# Altium project main.PrjPCB
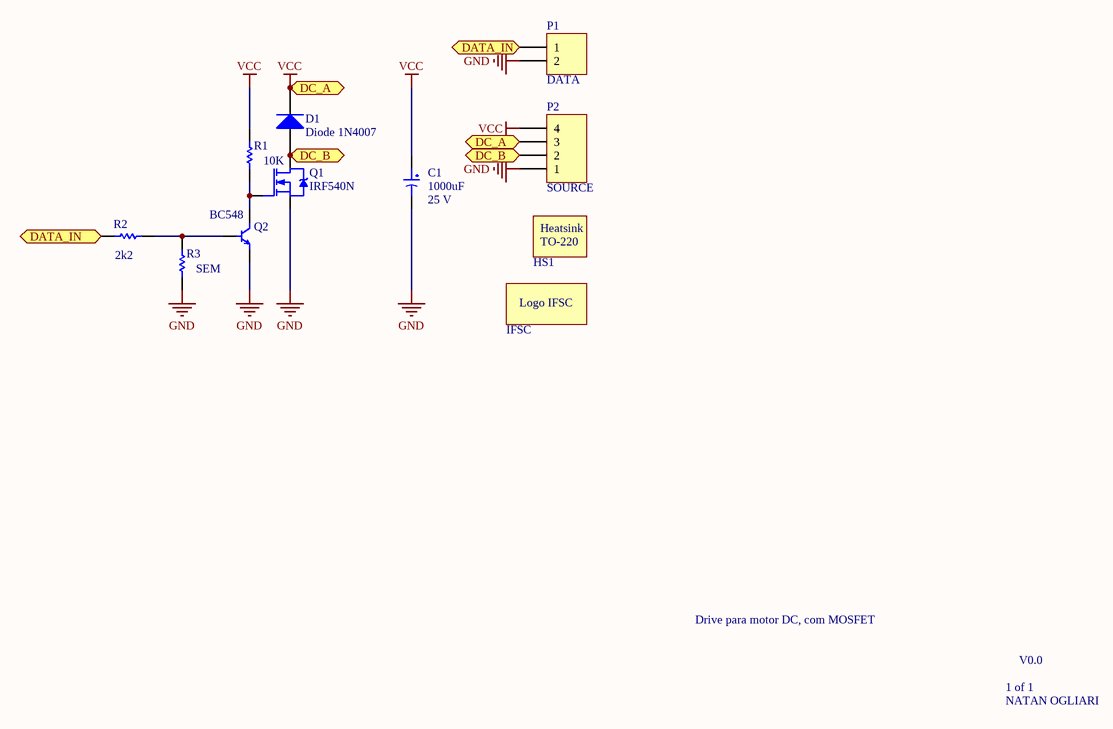
[diagram p0: Sheet1.SchDoc]
1 sheet, 11 parts. Net scope: flat (ports and power ports of the same name join across sheets).
Board file: PCB1.PcbDoc

## Sheet Sheet1.SchDoc
size A4; PageSetup: Record=PageOptions|CenterHorizontal=True|CenterVertical=True|PrintScale=1.00|XCorrection=1.00|YCorrection=1.00|PrintKind=0|BorderSize=5000000|LeftOffset=0|BottomOffset=0|Orientation=2|PaperLength=1000|PaperWidth=1000|Scale=100|PaperSource=7|PrintQuality=-4|MediaType=1|DitherType=10|PaperKind=A4|PrintScaleMode=0

### Parts
C1  1000uF  Voltage: 25 V  [CP-RAD-8.0mm-20.0mm-3.5mm]
D1  Diode 1N4007  [DO-41]
HS1  HS-TO-220  [HS-TO-220-180847]  (value not drawn)
P1  DATA  [HDR1X2]
P2  SOURCE  [KRE_4]
Q1  IRF540N  [TO-220/123]
Q2  BC548  [TO-92/CBE]
R1  value 10K  [AXIAL-0.5]  (hidden comment: Res Semi)
R2  value 2k2  [AXIAL-0.5]  (hidden comment: Res Semi)
R3  value SEM  [AXIAL-0.5]  (hidden comment: Res Semi)
X1  IFSC  [IFSC_SILK]

### Ports
DATA_IN (in), DATA_IN (out), DC_A (bidir), DC_B (bidir)

### Nets
GND: C1.2 P1.2 P2.1 Q1.S Q2.E R3.1
VCC: C1.1 D1.2(K) P2.3 P2.4 R1.2 ; port DC_A
NetD1_1: D1.1(A) P2.2 Q1.D ; port DC_B
NetP1_1: P1.1 R2.1 ; port DATA_IN
NetQ1_G: Q1.G Q2.C R1.1
NetQ2_B: Q2.B R2.2 R3.2

### Notes on the sheet
- Drive para motor DC, com MOSFET
- 1 of 1
- V0.0
- NATAN OGLIARI
- (in symbol HS-TO-220) Heatsink; TO-220
- (in symbol IFSC) Logo IFSC

### Library data of the parts
C1 = Capacitor-Electrolytic: Electrolytic Capacitor
D1 = Diode 1N4007: 1 Amp General Purpose Rectifier; Published: 8-Jun-2000; LatestRevisionDate: 17-Jul-2002; LatestRevisionNote: Re-released for DXP Platform.; DatasheetVersion: 1998; PackageVersion: Aug-1999; PackageReference: DO-41; Publisher: Altium Limited; PackageDescription: Diode, Axial; Body 5.2 x 2.7 mm (LxDia. max), Lead Dia. 0.86 mm (max); Code_JEDEC: DO-204-AL; ComponentLink1Description: Manufacturer Link; ComponentLink1URL: http://www.fairchildsemi.com/; ComponentLink2Description: Datasheet; ComponentLink2URL: http://www.fairchildsemi.com/ds/1N%2F1N4001.pdf
HS1 = HS-TO-220: Heatsink TO-220
P1 = Header 2: Header, 2-Pin; LatestRevisionDate: 17-Jul-2002; LatestRevisionNote: Re-released for DXP Platform.; Publisher: Altium Limited
P2 = KRE_4: Terminal Block 1x4
Q1 = IRFZ46N: HEXFET Power MOSFET; pin to pad: D>2 G>1 S>3; Drain Current (Id): 53 A; Drain Current Peak (Idp): 180 A; Power Dissipation (Pd): 107 W; Gate-to-Source Voltage (Vgs): 20 V; Static Drain-to-Source On-Resistance (Rdson): 16.5 mR; Turn-On Delay (tdon): 14 ns; Rise Time (Rt): 76 ns; Fall Time (Tf): 57 ns; Turn-Off Delay (Tdoff): 52 ns
Q2 = BC548: NPN Epitaxial Silicon Transistor; Complementary Part: BC558; Collector-Base Voltage (Vcb): 30 V; Emitter-Base Voltage (Veb): 5 V; Collector Current (Ic): 100 mA; Total Power Dissipation (Ptot): 500 mW; DC Current Gain Min (hfe): 110; DC Current Gain Max (hfe): 800; Transition Frequency (fT): 300 MHz; Collector-Emitter Voltage (Vce): 30 V
R1-R3 = Res Semi: Semiconductor Resistor; Published: 8-Jun-2000; LatestRevisionDate: 17-Jul-2002; LatestRevisionNote: Re-released for DXP Platform.; PackageReference: AXIAL-0.5; Publisher: Altium Limited; PackageDescription: Axial Device, Thru-Hole; 2 Leads; 0.5 in Pin Spacing
X1 = IFSC: Logomarca IFSC